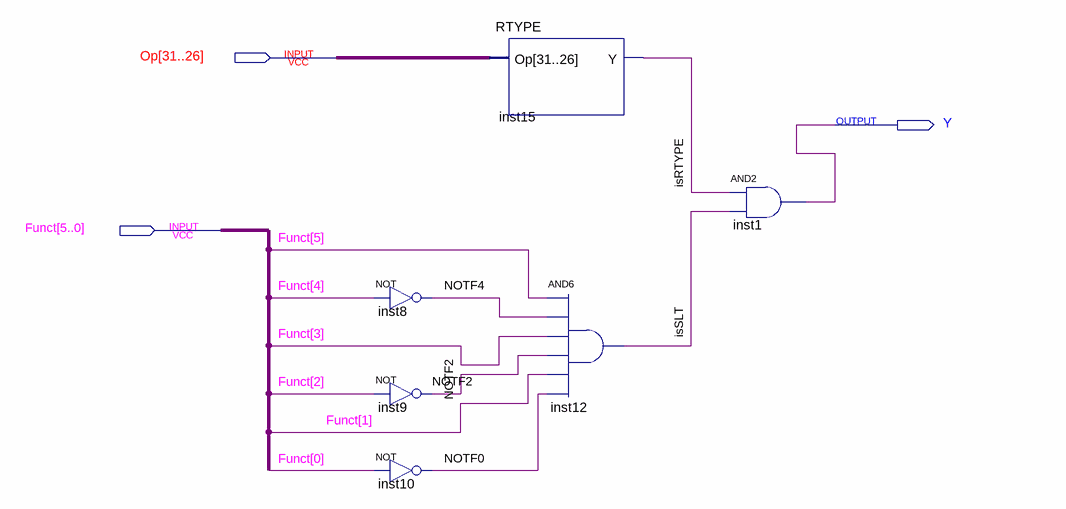
[diagram p0: schematic sheet]
// Quartus schematic SLT.bdf as structural Verilog: 6 symbols, 3 pins
module SLT (
  input  [31:26] Op,
  input  [5:0] Funct,
  output Y
);

  wire isRTYPE, isSLT, NOTF0, NOTF2, NOTF4;

  not inst8 (NOTF4, Funct[4]);
  not inst9 (NOTF2, Funct[2]);
  not inst10 (NOTF0, Funct[0]);
  RTYPE inst15 (.Op(Op), .Y(isRTYPE));
  and inst12 (isSLT, Funct[5], NOTF4, Funct[3], NOTF2, Funct[1], NOTF0);
  and inst1 (Y, isRTYPE, isSLT);
endmodule
